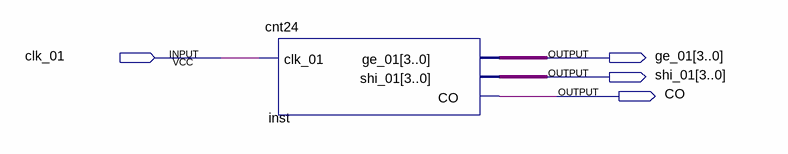
[diagram p0: schematic sheet]
// Quartus schematic bin_hour.bdf as structural Verilog: 1 symbols, 4 pins
module bin_hour (
  input  clk_01,
  output [3:0] ge_01,
  output [3:0] shi_01,
  output CO
);

  cnt24 inst (.clk_01(clk_01), .ge_01(ge_01), .shi_01(shi_01), .CO(CO));
endmodule
